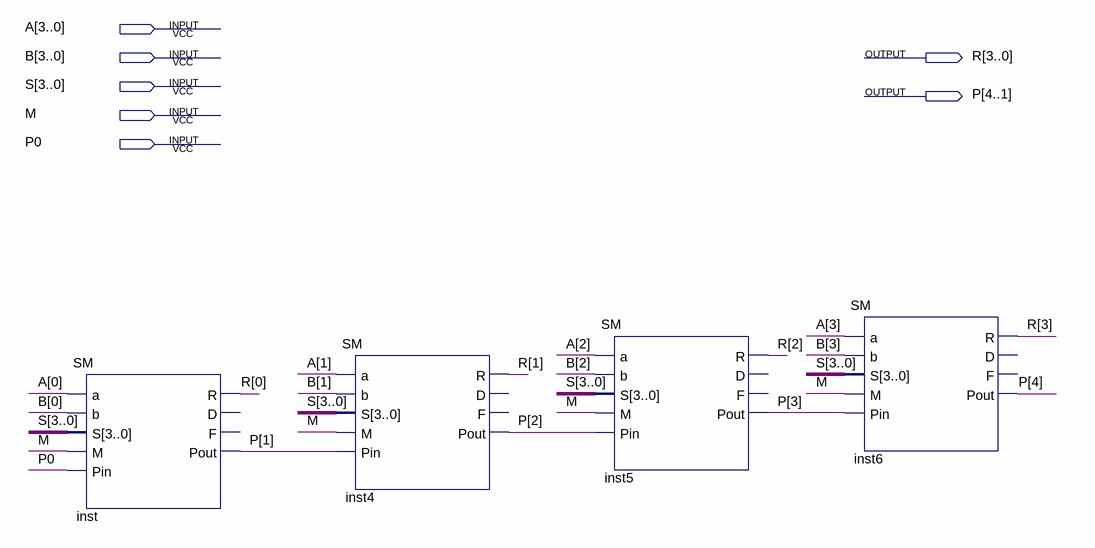
[diagram p0: schematic sheet]
// Quartus schematic ALU_SerialCarry.bdf as structural Verilog: 4 symbols, 7 pins
module ALU_SerialCarry (
  input  [3:0] A,
  input  [3:0] B,
  input  [3:0] S,
  input  M,
  input  P0,
  output [3:0] R,
  output [4:1] P
);

  SM inst (.a(A[0]), .b(B[0]), .S(S), .M(M), .Pin(P0), .R(R[0]), .Pout(P[1]));  // open: D, F
  SM inst4 (.a(A[1]), .b(B[1]), .S(S), .M(M), .Pin(P[1]), .R(R[1]), .Pout(P[2]));  // open: D, F
  SM inst5 (.a(A[2]), .b(B[2]), .S(S), .M(M), .Pin(P[2]), .R(R[2]), .Pout(P[3]));  // open: D, F
  SM inst6 (.a(A[3]), .b(B[3]), .S(S), .M(M), .Pin(P[3]), .R(R[3]), .Pout(P[4]));  // open: D, F
endmodule
